# Altium schematic sheet dali_dmx_ctrl_blk.SchDoc
size A4; Engineer: JBayalas; DocumentNumber: 9; Revision: V4.3.0; SheetNumber: 9; SheetTotal: 14
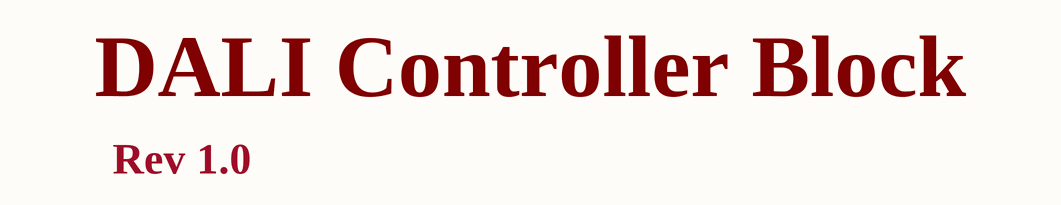
[diagram p0: dali_dmx_ctrl_blk.SchDoc]

## Notes on the sheet
- DALI Controller Block
- Rev 1.0
- Title:
- Sheet:
- Date:
- of
- Project:
- Revision:
- Engineer:
- Wi4B S.r.l